# EAGLE design boost-test-2 (EAGLE 9.6.2)
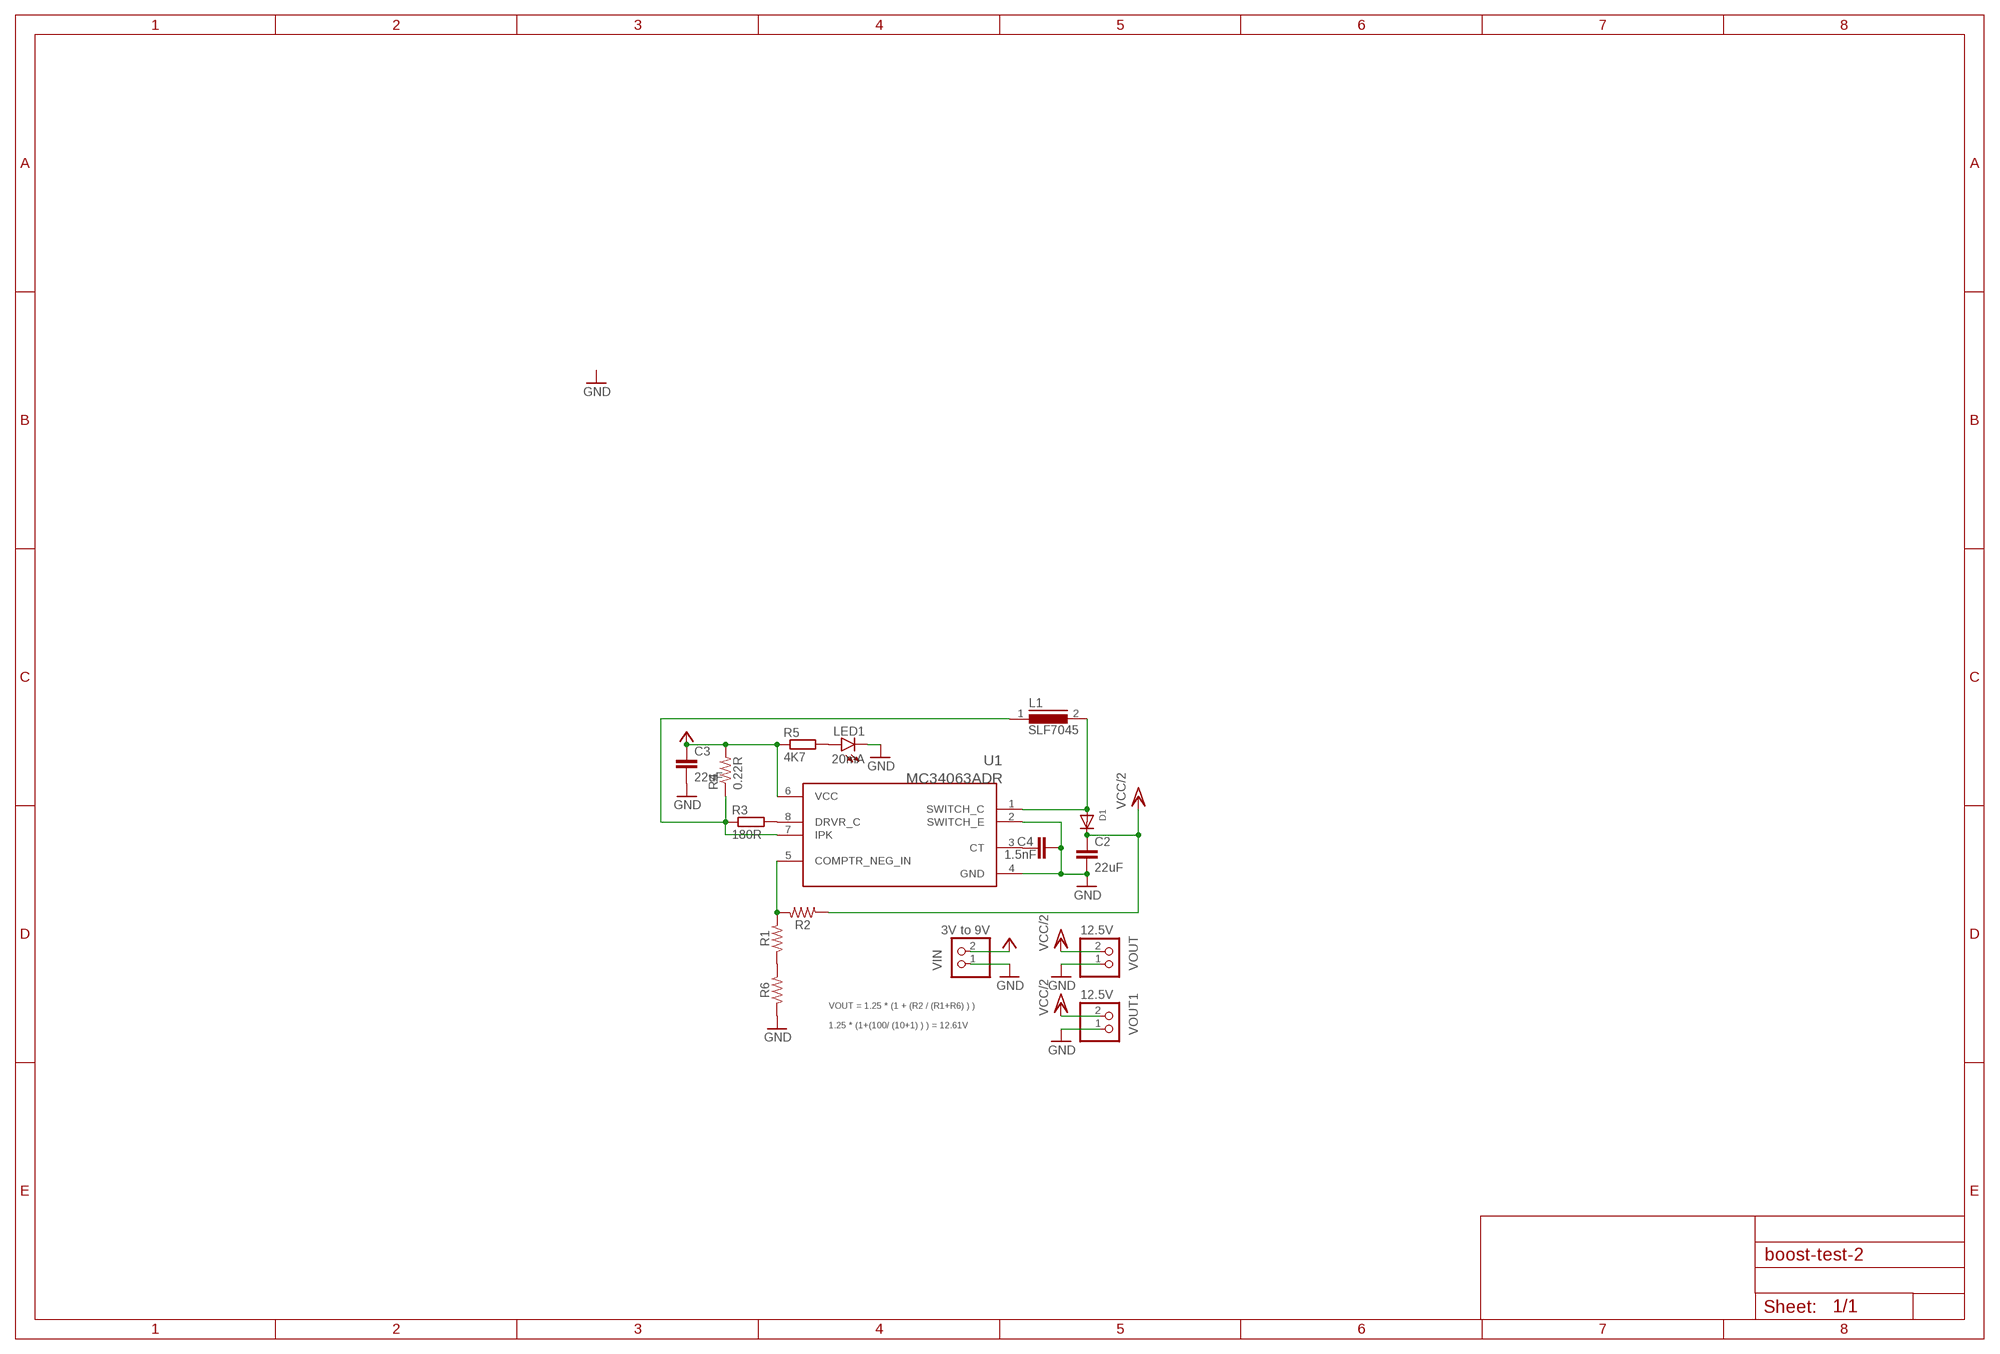
[diagram p0: schematic, sheet 1]

## Parts
C2  22uF  22UF-0805-6.3V-20%  [0805]
C3  22uF  22UF-0805-6.3V-20%  [0805]
C4  1.5nF  C-EUC0603  [C0603]
D1  ADAFRUIT_DIODESOD-123  [ADAFRUIT_SOD-123]
L1  SLF7045  [SLF7045]
LED1  20mA  LEDCHIP-LED0603  [CHIP-LED0603]
R1  10K  52101-101-REV-A_RC-MASTER-SMD_R_0603MP  [52101-101-REV-A_RC-MASTER-SMD_R0603MP]
R2  100K  52101-101-REV-A_RC-MASTER-SMD_R_0603MP  [52101-101-REV-A_RC-MASTER-SMD_R0603MP]
R3  180R  R-EU_R0402  [R0402]
R4  0.22R  R-US_M0805  [M0805]
R5  4K7  R-EU_R0402  [R0402]
R6  1K  52101-101-REV-A_RC-MASTER-SMD_R_0603MP  [52101-101-REV-A_RC-MASTER-SMD_R0603MP]
U1  MC34063ADR  [SOIC127P599X175-8N]
VIN  3V to 9V  PINHD-1X2  [1X02]
VOUT  12.5V  PINHD-1X2  [1X02]
VOUT1  12.5V  PINHD-1X2  [1X02]

## Nets
GND: C2.2 C3.2 C4.1 LED1.C R6.1 U1.2(SWITCH_E) U1.4(GND) VIN.1 VOUT1.1 VOUT.1
N$1: D1.A L1.2 U1.1(SWITCH_C)
N$2: R3.2 U1.8(DRVR_C)
N$3: C4.2 U1.3(CT)
N$4: L1.1 R3.1 R4.1 U1.7(IPK)
N$5: R1.2 R2.2 U1.5(COMPTR_NEG_IN)
N$6: LED1.A R5.2
N$7: R1.1 R6.2
VCC: C3.1 R4.2 R5.1 U1.6(VCC) VIN.2
VCC/2: C2.1 D1.C R2.1 VOUT1.2 VOUT.2

## Notes on the sheet
- VOUT = 1.25 * (1 + (R2 / (R1+R6) ) )
  
  1.25 * (1+(100/ (10+1) ) ) = 12.61V

## Library data of the parts
C2 C3 = SparkFun-Capacitors:22UF: 22µF ceramic capacitors A capacitor is a passive two-terminal electrical component used to store electrical energy temporarily in an electric field.; PROD_ID: CAP-08402
C4 = rcl:C-EU: CAPACITOR, European symbol; SPICEPREFIX: C
D1 = locker-controller:ADAFRUIT_DIODE: Diode SMADIODE - SMA Surface Mount Package 20V 1A Schottky Diode Digikey: 641-1014-6-ND DO-1N4148 - Through Hole Small Current Diode SOD-123 20V 1 A (.5mV Vf) Schottky Diode - Digikey: MBRX120TPMSCT-ND SOD-323 10V 570mA (.38mV Vf, 3ns) Schottky Diode - Digikey: ZLLS410CT-ND SOD-523 30V 30mA Schottky Diode (RB751S-40TE61) - Digikey: RB751S-40TE61CT-ND SOT23-R/W - SOT23 Package (R = Solder Paste/Reflow Ovens, W = Hand-Soldering) BAT54Film 40V 300mA - Digikey: 497-7162-1-ND
L1 = inductors:SLF7045: SMD Inductors(Coils) For Power Line (Wound, Magnetic Shielded) Source: TDK, e531_slf7045.pdf; SPICEPREFIX: L
LED1 = led:LED: LED OSRAM: - CHIPLED LG R971, LG N971, LY N971, LG Q971, LY Q971, LO R971, LY R971 LH N974, LH R974 LS Q976, LO Q976, LY Q976 LO Q996 - Hyper CHIPLED LW Q18S LB Q993, LB Q99A, LB R99A - SideLED LS A670, LO A670, LY A670, LG A670, LP A670 LB A673, LV A673, LT A673, LW A673 LH A674 LY A675 LS A676, LA A676, LO A676, LY A676, LW A676 LS A679, LY A679, LG A679 - Hyper Micro SIDELED® LS Y876, LA Y876, LO Y876, LY Y876 LT Y87S - SmartLED LW L88C, LW L88S LB L89C, LB L89S, LG L890 LS L89K, LO L89K, LY L89K LS L896, LA L896, LO L896, LY L896 - TOPLED LS T670, LO T670, LY T670, LG T670, LP T670 LSG T670, LSP T670, LSY T670, LOP T670, LYG T670 LG T671, LOG T671, LSG T671 LB T673, LV T673, LT T673, LW T673 LH T674 LS T676, LA T676, LO T676, LY T676, LB T676, LH T676, LSB T676, LW T676 LB T67C, LV T67C, LT T67C, LS T67K, LO T67K, LY T67K, LW E67C LS E67B, LA E67B, LO E67B, LY E67B, LB E67C, LV E67C, LT E67C LW T67C LS T679, LY T679, LG T679 LS T770, LO T770, LY T770, LG T770, LP T770 LB T773, LV T773, LT T773, LW T773 LH T774 LS E675, LA E675, LY E675, LS T675 LS T776, LA T776, LO T776, LY T776, LB T776 LHGB T686 LT T68C, LB T68C - Hyper Mini TOPLED® LB M676 - Mini TOPLED Santana® LG M470 LS M47K, LO M47K, LY M47K Source: http://www.osram.convergy.de LUXEON: - LUMILED® LXK2-PW12-R00, LXK2-PW12-S00, LXK2-PW14-U00, LXK2-PW14-V00 LXK2-PM12-R00, LXK2-PM12-S00, LXK2-PM14-U00 LXK2-PE12-Q00, LXK2-PE12-R00, LXK2-PE12-S00, LXK2-PE14-T00, LXK2-PE14-U00 LXK2-PB12-K00, LXK2-PB12-L00, LXK2-PB12-M00, LXK2-PB14-N00, LXK2-PB14-P00, LXK2-PB14-Q00 LXK2-PR12-L00, LXK2-PR12-M00, LXK2-PR14-Q00, LXK2-PR14-R00 LXK2-PD12-Q00, LXK2-PD12-R00, LXK2-PD12-S00 LXK2-PH12-R00, LXK2-PH12-S00 LXK2-PL12-P00, LXK2-PL12-Q00, LXK2-PL12-R00 Source: www.luxeon.com KINGBRIGHT: KA-3528ASYC Source: www.kingbright.com
R1 R2 R6 = ESP32_DMX_Audio:52101-101-REV-A_RC-MASTER-SMD_R_: RESISTOR
R3 R5 = rcl:R-EU_: RESISTOR, European symbol; SPICEPREFIX: R
R4 = adafruit:R-US_: RESISTOR, American symbol
U1 = MC34063ADR:MC34063ADR: 1.5-A Boost/Buck/Inverting Switching Regulator 8-SOIC 0 to 70 Check prices <https://pricing.snapeda.com/parts/MC34063ADR/Texas%20Instruments/view-part?ref=eda>; AVAILABILITY: Warning; DESCRIPTION: 1.5-A Boost/Buck/Inverting Switching Regulator 8-SOIC 0 to 70; MF: Texas Instruments; MP: MC34063ADR; PACKAGE: SOIC-8 Texas Instruments; PRICE: None; PURCHASE-URL: https://pricing.snapeda.com/search/part/MC34063ADR/?ref=eda
VIN VOUT VOUT1 = pinhead:PINHD-1X2: PIN HEADER

## Board
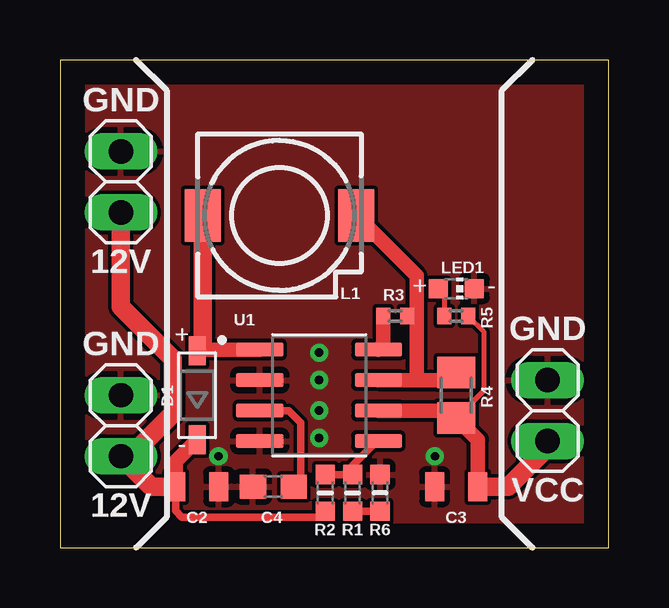
[diagram p1: board, top side]
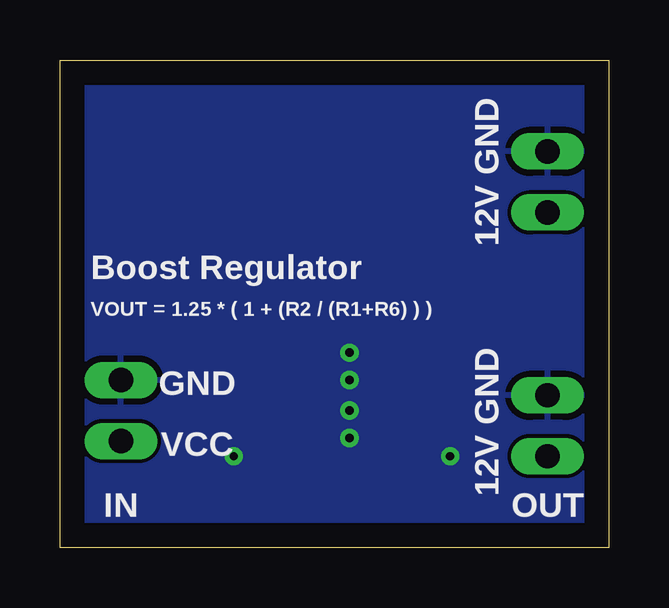
[diagram p2: board, bottom side, seen from below]

Size 22.86 x 20.32 mm. Coordinates in mm from the lower left corner, seen from the top.
Outline: 0,0 22.86,0 22.86,20.32 0,20.32 0,0
Copper layers (1*16): Top 0.035mm / dielectric 1.5mm / Bottom 0.035mm
Design rules "default": minimum track width 6mil, minimum drill 0.35mm, track to track 6mil, track to pad 6mil, pad to pad 6mil, via to via 6mil, smd to smd 6mil, copper to edge 40mil, drill to drill 6mil, minimum pad ring 10mil, minimum via ring 8mil, stop-mask expansion 4mil, vias tented up to drill 0mil, thermal gap 10mil

### Footprints (pad centres in the part's own frame; a part is rotated, then mirrored left to right if it is on the bottom)
0805 = smd 0.8 x 1.2: 1 -0.9,0; 2 0.9,0
C0603 = smd 1.1 x 1: 1 -0.85,0; 2 0.85,0
ADAFRUIT_SOD-123 = smd 1.2 x 0.7: A 1.85,0; C -1.85,0
SLF7045 = smd 1.5 x 2.2: 1 -3.2,0; 2 3.2,0
CHIP-LED0603 = smd 0.8 x 0.8: A 0,-0.75; C 0,0.75
52101-101-REV-A_RC-MASTER-SMD_R0603MP = smd 0.8 x 0.8: 1 -0.762,0; 2 0.762,0
R0402 = smd 0.6 x 0.7: 1 -0.5,0; 2 0.5,0
M0805 = smd 1.3 x 1.6: 1 -0.95,0; 2 0.95,0
SOIC127P599X175-8N = smd 1.97 x 0.6: 1 -2.47,1.905; 2 -2.47,0.635; 3 -2.47,-0.635; 4 -2.47,-1.905; 5 2.47,-1.905; 6 2.47,-0.635; 7 2.47,0.635; 8 2.47,1.905
1X02 = drill 1.016 long: 1 -1.27,0; 2 1.27,0

### Placement (x,y rotation side)
C2  5.71,2.54 0 top
C3  16.51,2.54 180 top
C4  8.89,2.54 0 top
D1  5.71,6.35 90 top
L1  9.14,13.84 180 top
LED1  16.51,10.79 270 top
R1  12.19,2.29 90 top
R2  11.05,2.29 90 top
R3  13.97,9.65 180 top
R4  16.51,6.35 270 top
R5  16.51,9.65 180 top
R6  13.34,2.29 270 top
U1  10.79,6.35 0 top
VIN  20.32,5.71 270 top
VOUT  2.54,5.08 270 top
VOUT1  2.54,15.24 270 top

### Tracks (layer width: path | path; a pad name or v marks a point on that pad's centre or on a via)
GND  (via drill 0.35)
  other vias: 10.79,8.13 10.79,6.99 10.79,5.71 10.79,4.57 6.6,3.81 15.62,3.81
  pour Top: -1.27,22.23 23.5,22.23 23.5,-1.27 -1.27,-1.27
  pour Bottom: -1.27,22.23 23.5,22.23 23.5,-1.27 -1.27,-1.27
N$1
  Top 0.305: 5.77,8.26 D1.A
  Top 0.61: U1.1 5.77,8.26
  Top 0.762: L1.2 5.94,8.43 5.77,8.26
N$2
  Top 0.61: R3.2 13.47,8.46 U1.8
N$3
  Top 0.305: U1.3 9.53,5.71 10.03,5.21 10.03,2.83 C4.2
N$4
  Top 0.508: 14.86,7.24 14.61,6.99 | 16.2,6.99 R4.1
  Top 0.61: U1.7 14.61,6.99 16.2,6.99 | 14.86,7.24 14.86,9.65 | 14.86,9.65 14.86,11.33 L1.1 | R3.1 14.86,9.65
N$5
  Top 0.305: R2.2 R1.2 12.19,3.43 13.21,4.45 U1.5
N$6
  Top 0.203: LED1.A 16.01,10.54 R5.2
N$7
  Top 0.305: R1.1 R6.2
VCC
  Top 0.203: R5.1 17.65,9.01 17.65,6.54 16.56,5.45
  Top 0.305: 16.56,5.45 R4.2 16.2,5.71
  Top 0.61: U1.6 16.2,5.71 | C3.1 17.41,4.5 R4.2
  Top 0.762: VIN.2 20.32,4.18 18.68,2.54 C3.1
VCC/2
  Top 0.305: C2.1 4.82,1.53 5.08,1.27 10.79,1.27 R2.1
  Top 0.61: D1.C 4.82,3.6 C2.1
  Top 0.762: C2.1 3.81,2.54 VOUT.2 2.92,3.81 4.7,5.59 4.7,7.87 2.54,10.03 VOUT1.2

### Text on the board
tPlace: GND | 12V | + | - | + | GND | GND | - | VCC | 12V
bPlace: GND | 12V | Boost Regulator | VOUT = 1.25 * ( 1 + (R2 / (R1+R6) ) ) | GND | GND | VCC | 12V | OUT | IN